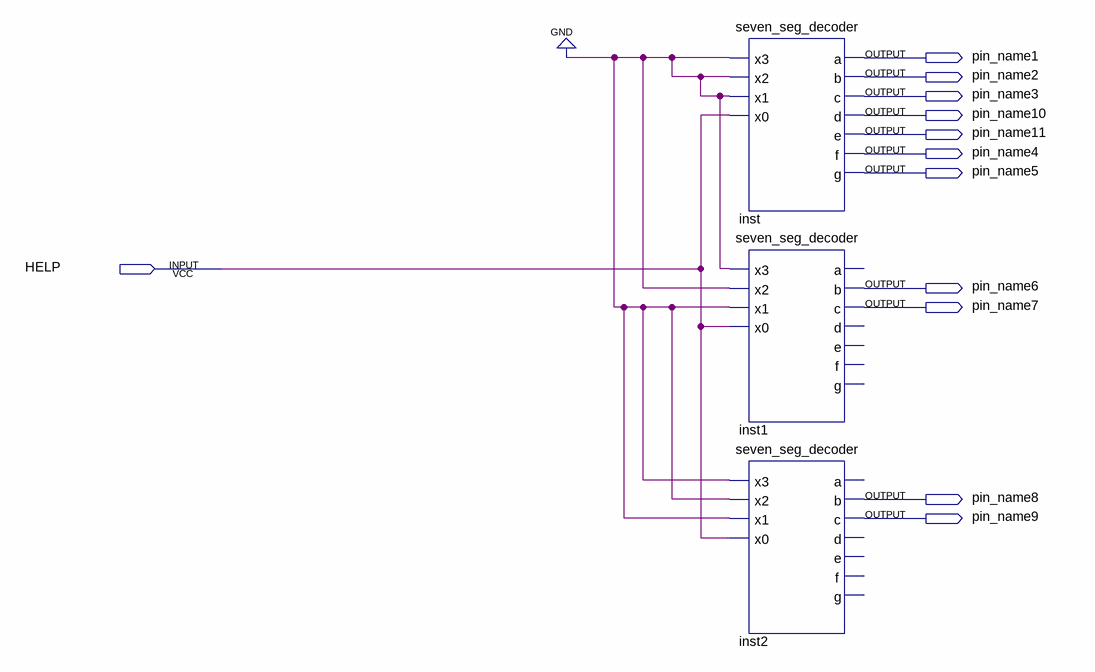
[diagram p0: schematic sheet]
// Quartus schematic 911.bdf as structural Verilog: 3 symbols, 12 pins
module \911  (
  input  HELP,
  output pin_name1,
  output pin_name2,
  output pin_name3,
  output pin_name10,
  output pin_name11,
  output pin_name4,
  output pin_name5,
  output pin_name6,
  output pin_name7,
  output pin_name8,
  output pin_name9
);

  seven_seg_decoder inst (
    .x3(1'b0), .x2(1'b0), .x1(1'b0), .x0(HELP), .a(pin_name1), .b(pin_name2), .c(pin_name3), .d(pin_name10),
    .e(pin_name11), .f(pin_name4), .g(pin_name5));
  seven_seg_decoder inst1 (
    .x3(1'b0), .x2(1'b0), .x1(1'b0), .x0(HELP), .b(pin_name6), .c(pin_name7));  // open: a, d, e, f, g
  seven_seg_decoder inst2 (
    .x3(1'b0), .x2(1'b0), .x1(1'b0), .x0(HELP), .b(pin_name8), .c(pin_name9));  // open: a, d, e, f, g
endmodule
